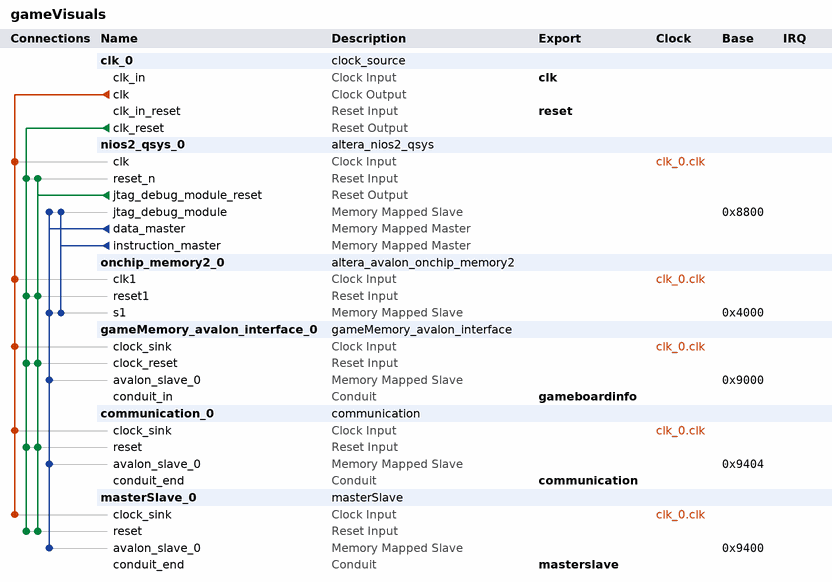
[diagram p0: system contents]
# Platform Designer (Qsys) system gameVisuals, Cyclone V 5CSEMA5F31C6
# Parameters at their usual value, and those the tool derives, are not listed.
package require -exact qsys 16.1
create_system gameVisuals
set_project_property DEVICE_FAMILY {Cyclone V}
set_project_property DEVICE 5CSEMA5F31C6

add_instance clk_0 clock_source 16.1
set_instance_parameter_value clk_0 clockFrequency 50000000

add_instance nios2_qsys_0 altera_nios2_qsys 16.1
set_instance_parameter_value nios2_qsys_0 breakSlave nios2_qsys_0.jtag_debug_module
set_instance_parameter_value nios2_qsys_0 exceptionSlave onchip_memory2_0.s1
set_instance_parameter_value nios2_qsys_0 icache_size 4096
set_instance_parameter_value nios2_qsys_0 impl Tiny
set_instance_parameter_value nios2_qsys_0 mmu_TLBMissExcSlave None
set_instance_parameter_value nios2_qsys_0 resetSlave onchip_memory2_0.s1
set_instance_parameter_value nios2_qsys_0 resetrequest_enabled true

add_instance onchip_memory2_0 altera_avalon_onchip_memory2 16.1
set_instance_parameter_value onchip_memory2_0 dataWidth 32
set_instance_parameter_value onchip_memory2_0 dualPort false
set_instance_parameter_value onchip_memory2_0 initMemContent true
set_instance_parameter_value onchip_memory2_0 initializationFileName onchip_mem.hex
set_instance_parameter_value onchip_memory2_0 memorySize 16384

add_instance gameMemory_avalon_interface_0 gameMemory_avalon_interface 1.0

add_instance communication_0 communication 1.0

add_instance masterSlave_0 masterSlave 1.0

# connections
add_connection clk_0.clk communication_0.clock_sink clock
add_connection clk_0.clk gameMemory_avalon_interface_0.clock_sink clock
add_connection clk_0.clk masterSlave_0.clock_sink clock
add_connection clk_0.clk nios2_qsys_0.clk clock
add_connection clk_0.clk onchip_memory2_0.clk1 clock
add_connection clk_0.clk_reset communication_0.reset reset
add_connection clk_0.clk_reset gameMemory_avalon_interface_0.clock_reset reset
add_connection clk_0.clk_reset masterSlave_0.reset reset
add_connection clk_0.clk_reset nios2_qsys_0.reset_n reset
add_connection clk_0.clk_reset onchip_memory2_0.reset1 reset
add_connection nios2_qsys_0.jtag_debug_module_reset communication_0.reset reset
add_connection nios2_qsys_0.jtag_debug_module_reset gameMemory_avalon_interface_0.clock_reset reset
add_connection nios2_qsys_0.jtag_debug_module_reset masterSlave_0.reset reset
add_connection nios2_qsys_0.jtag_debug_module_reset nios2_qsys_0.reset_n reset
add_connection nios2_qsys_0.jtag_debug_module_reset onchip_memory2_0.reset1 reset
add_connection nios2_qsys_0.data_master communication_0.avalon_slave_0 avalon
set_connection_parameter_value nios2_qsys_0.data_master/communication_0.avalon_slave_0 baseAddress 0x9404
add_connection nios2_qsys_0.data_master gameMemory_avalon_interface_0.avalon_slave_0 avalon
set_connection_parameter_value nios2_qsys_0.data_master/gameMemory_avalon_interface_0.avalon_slave_0 baseAddress 0x9000
add_connection nios2_qsys_0.data_master masterSlave_0.avalon_slave_0 avalon
set_connection_parameter_value nios2_qsys_0.data_master/masterSlave_0.avalon_slave_0 baseAddress 0x9400
add_connection nios2_qsys_0.data_master nios2_qsys_0.jtag_debug_module avalon
set_connection_parameter_value nios2_qsys_0.data_master/nios2_qsys_0.jtag_debug_module baseAddress 0x8800
add_connection nios2_qsys_0.data_master onchip_memory2_0.s1 avalon
set_connection_parameter_value nios2_qsys_0.data_master/onchip_memory2_0.s1 baseAddress 0x4000
add_connection nios2_qsys_0.instruction_master nios2_qsys_0.jtag_debug_module avalon
set_connection_parameter_value nios2_qsys_0.instruction_master/nios2_qsys_0.jtag_debug_module baseAddress 0x8800
add_connection nios2_qsys_0.instruction_master onchip_memory2_0.s1 avalon
set_connection_parameter_value nios2_qsys_0.instruction_master/onchip_memory2_0.s1 baseAddress 0x4000

# exported interfaces
add_interface clk clock sink
set_interface_property clk EXPORT_OF clk_0.clk_in
add_interface communication conduit end
set_interface_property communication EXPORT_OF communication_0.conduit_end
add_interface gameboardinfo conduit end
set_interface_property gameboardinfo EXPORT_OF gameMemory_avalon_interface_0.conduit_in
add_interface masterslave conduit end
set_interface_property masterslave EXPORT_OF masterSlave_0.conduit_end
add_interface reset reset sink
set_interface_property reset EXPORT_OF clk_0.clk_in_reset

set_interconnect_requirement {$system} qsys_mm.clockCrossingAdapter HANDSHAKE
set_interconnect_requirement {$system} qsys_mm.enableEccProtection FALSE
set_interconnect_requirement {$system} qsys_mm.insertDefaultSlave FALSE
set_interconnect_requirement {$system} qsys_mm.maxAdditionalLatency 1

save_system gameVisuals.qsys
